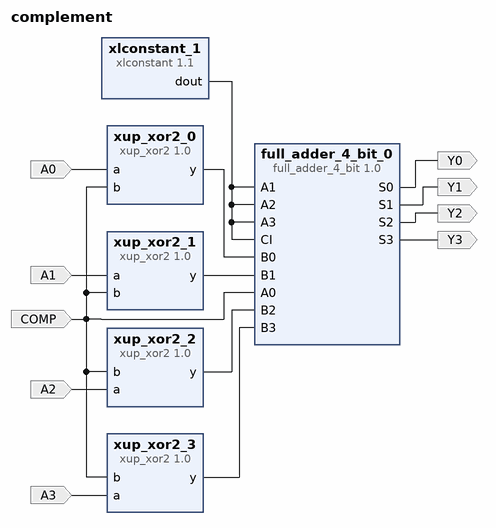
[diagram p0: block diagram of the top level]
# Vivado block design complement, xc7a35tcpg236-1, Vivado 2016.3
create_bd_design complement

create_bd_port -dir O Y0
create_bd_port -dir O Y1
create_bd_port -dir O Y2
create_bd_port -dir O Y3
create_bd_port -dir I COMP
create_bd_port -dir I A3
create_bd_port -dir I A2
create_bd_port -dir I A1
create_bd_port -dir I A0

create_bd_cell -type ip -vlnv xilinx.com:user:full_adder_4_bit:1.0 full_adder_4_bit_0
create_bd_cell -type ip -vlnv xilinx.com:ip:xlconstant:1.1 xlconstant_1
set_property -dict {CONFIG.CONST_VAL 0} [get_bd_cells xlconstant_1]
create_bd_cell -type ip -vlnv xilinx.com:xup:xup_xor2:1.0 xup_xor2_0
create_bd_cell -type ip -vlnv xilinx.com:xup:xup_xor2:1.0 xup_xor2_1
create_bd_cell -type ip -vlnv xilinx.com:xup:xup_xor2:1.0 xup_xor2_2
create_bd_cell -type ip -vlnv xilinx.com:xup:xup_xor2:1.0 xup_xor2_3

# ---- connections ----

connect_bd_net [get_bd_pins xlconstant_1/dout] \
  [get_bd_pins full_adder_4_bit_0/A1] [get_bd_pins full_adder_4_bit_0/A2] [get_bd_pins full_adder_4_bit_0/A3] \
  [get_bd_pins full_adder_4_bit_0/CI]
connect_bd_net [get_bd_pins full_adder_4_bit_0/S0] [get_bd_ports Y0]
connect_bd_net [get_bd_pins full_adder_4_bit_0/S1] [get_bd_ports Y1]
connect_bd_net [get_bd_pins full_adder_4_bit_0/S2] [get_bd_ports Y2]
connect_bd_net [get_bd_pins full_adder_4_bit_0/S3] [get_bd_ports Y3]
connect_bd_net [get_bd_ports COMP] \
  [get_bd_pins full_adder_4_bit_0/A0] [get_bd_pins xup_xor2_3/b] [get_bd_pins xup_xor2_2/b] [get_bd_pins xup_xor2_1/b] \
  [get_bd_pins xup_xor2_0/b]
connect_bd_net -net A3_1 [get_bd_ports A3] [get_bd_pins xup_xor2_3/a]
connect_bd_net -net A2_1 [get_bd_ports A2] [get_bd_pins xup_xor2_2/a]
connect_bd_net -net A1_1 [get_bd_ports A1] [get_bd_pins xup_xor2_1/a]
connect_bd_net -net A0_1 [get_bd_ports A0] [get_bd_pins xup_xor2_0/a]
connect_bd_net [get_bd_pins xup_xor2_3/y] [get_bd_pins full_adder_4_bit_0/B3]
connect_bd_net [get_bd_pins xup_xor2_2/y] [get_bd_pins full_adder_4_bit_0/B2]
connect_bd_net [get_bd_pins xup_xor2_1/y] [get_bd_pins full_adder_4_bit_0/B1]
connect_bd_net [get_bd_pins xup_xor2_0/y] [get_bd_pins full_adder_4_bit_0/B0]

validate_bd_design
save_bd_design
